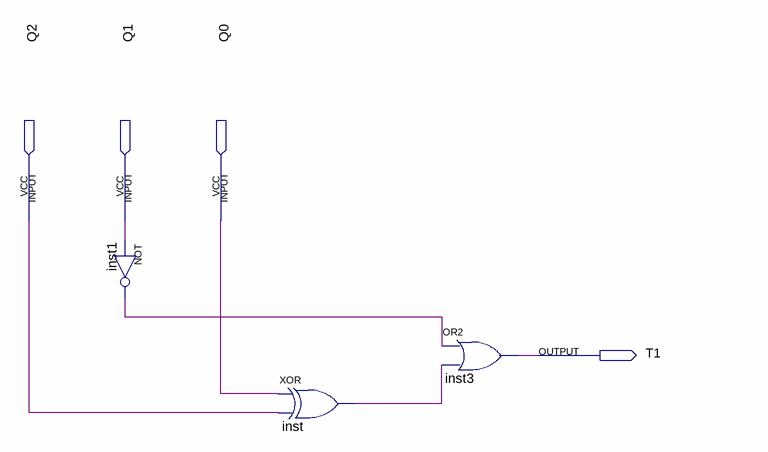
[diagram p0: schematic sheet]
// Quartus schematic T1.bdf as structural Verilog: 3 symbols, 4 pins
module T1 (
  input  Q2,
  input  Q1,
  input  Q0,
  output T1
);

  wire inst1_out, inst_out;

  not inst1 (inst1_out, Q1);
  xor inst (inst_out, Q0, Q2);
  or inst3 (T1, inst1_out, inst_out);
endmodule
